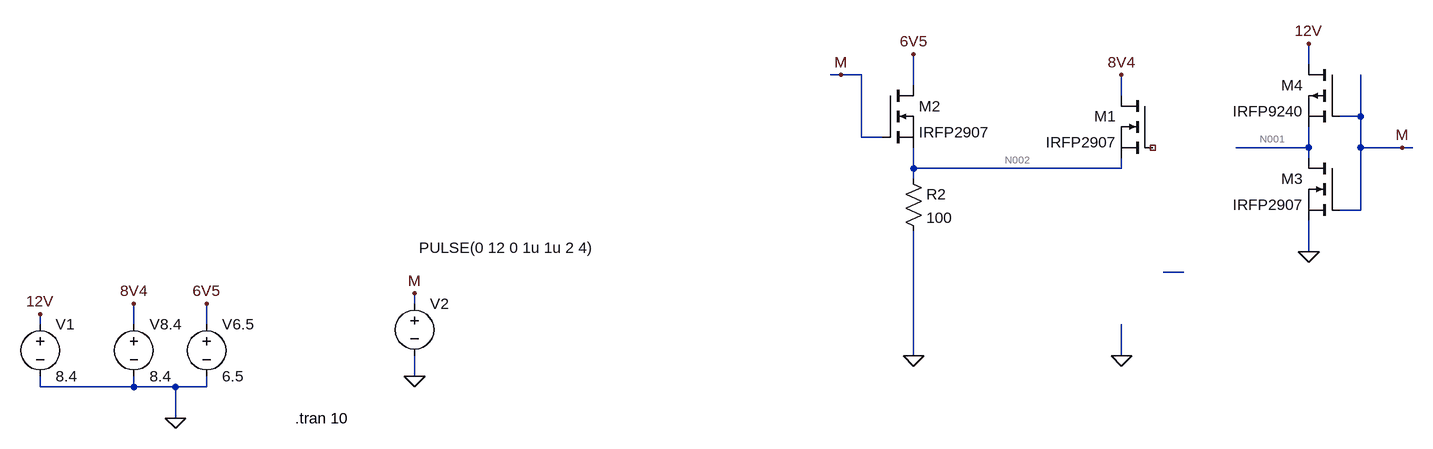
[diagram p0: schematic Draft4 — kopia.asc]
Draft4 — kopia.asc, the LTspice schematic file:
Version 4
SHEET 1 2004 716
WIRE 1632 -192 1632 -224
WIRE 912 -176 896 -176
WIRE 944 -176 912 -176
WIRE 1024 -160 1024 -208
WIRE 1344 -144 1344 -176
WIRE 1712 -112 1712 -176
WIRE 1712 -112 1680 -112
WIRE 944 -80 944 -176
WIRE 976 -80 944 -80
WIRE 1632 -64 1632 -96
WIRE 1632 -64 1520 -64
WIRE 1712 -64 1712 -112
WIRE 1776 -64 1712 -64
WIRE 1792 -64 1776 -64
WIRE 1632 -48 1632 -64
WIRE 1024 -32 1024 -64
WIRE 1344 -32 1344 -48
WIRE 1344 -32 1024 -32
WIRE 1024 -16 1024 -32
WIRE 1712 32 1712 -64
WIRE 1712 32 1680 32
WIRE 1632 96 1632 48
WIRE 1440 128 1408 128
WIRE 256 176 256 160
WIRE -320 208 -320 192
WIRE -176 208 -176 176
WIRE -64 208 -64 176
WIRE 1024 256 1024 64
WIRE 1344 256 1344 208
WIRE 256 288 256 256
WIRE -320 304 -320 288
WIRE -176 304 -176 288
WIRE -176 304 -320 304
WIRE -112 304 -176 304
WIRE -64 304 -64 288
WIRE -64 304 -112 304
WIRE -112 352 -112 304
FLAG 256 160 M
FLAG 256 288 0
FLAG -64 176 6V5
FLAG -176 176 8V4
FLAG -112 352 0
FLAG 1024 256 0
FLAG 1632 96 0
FLAG 1024 -208 6V5
FLAG 1776 -64 M
FLAG 912 -176 M
FLAG 1344 256 0
FLAG 1344 -176 8V4
FLAG -320 192 12V
FLAG 1632 -224 12V
SYMBOL voltage 256 160 R0
WINDOW 3 7 -70 Left 2
WINDOW 123 0 0 Left 0
WINDOW 39 0 0 Left 0
SYMATTR Value PULSE(0 12 0 1u 1u 2 4)
SYMATTR InstName V2
SYMBOL voltage -176 192 R0
SYMATTR InstName V8.4
SYMATTR Value 8.4
SYMBOL voltage -64 192 R0
WINDOW 123 0 0 Left 0
WINDOW 39 0 0 Left 0
SYMATTR InstName V6.5
SYMATTR Value 6.5
SYMBOL nmos 1680 -48 M0
SYMATTR InstName M3
SYMATTR Value IRFP2907
SYMBOL pmos 1680 -192 M0
SYMATTR InstName M4
SYMATTR Value IRFP9240
SYMBOL res 1008 -32 R0
SYMATTR InstName R2
SYMATTR Value 100
SYMBOL nmos 976 -160 R0
SYMATTR InstName M2
SYMATTR Value IRFP2907
SYMBOL nmos 1392 -144 M0
SYMATTR InstName M1
SYMATTR Value IRFP2907
SYMBOL voltage -320 192 R0
SYMATTR InstName V1
SYMATTR Value 8.4
TEXT 72 352 Left 2 !.tran 10

The netlist it stands for:
* Draft4 — kopia.asc
V2 M 0 PULSE(0 12 0 1u 1u 2 4)
V8.4 8V4 0 8.4
V6.5 6V5 0 6.5
M3 N001 M 0 0 IRFP2907
M4 12V M N001 N001 IRFP9240
R2 N002 0 100
M2 6V5 M N002 N002 IRFP2907
M1 8V4 NC_01 N002 N002 IRFP2907
V1 12V 0 8.4
.model NMOS NMOS
.model PMOS PMOS
.lib standard.mos
.tran 10
.backanno
.end

* Results of the author's LTspice run, read from the files saved beside the schematic
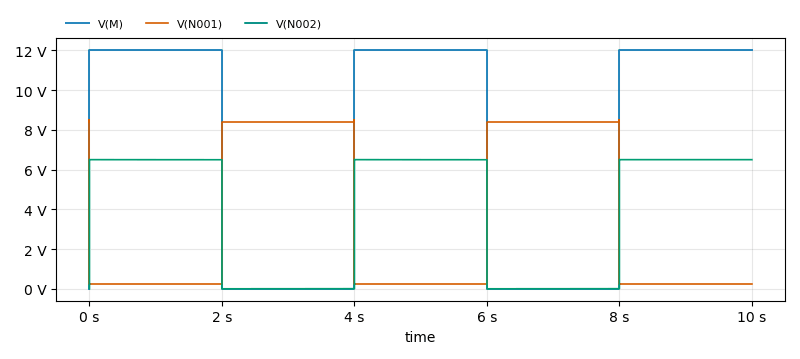
[diagram p1: Transient Analysis of Draft4 — kopia.asc, plotted from the saved traces]
* Transient Analysis, 1 run:
*   V(M): min 0 V, max 12 V, average 7.2 V, rms 9.295 V, last 12 V
*   V(N001): min 236.9 mV, max 8.478 V, average 3.502 V, rms 5.316 V, last 237 mV
*   V(N002): min 0 V, max 6.503 V, average 3.9 V, rms 5.034 V, last 6.499 V